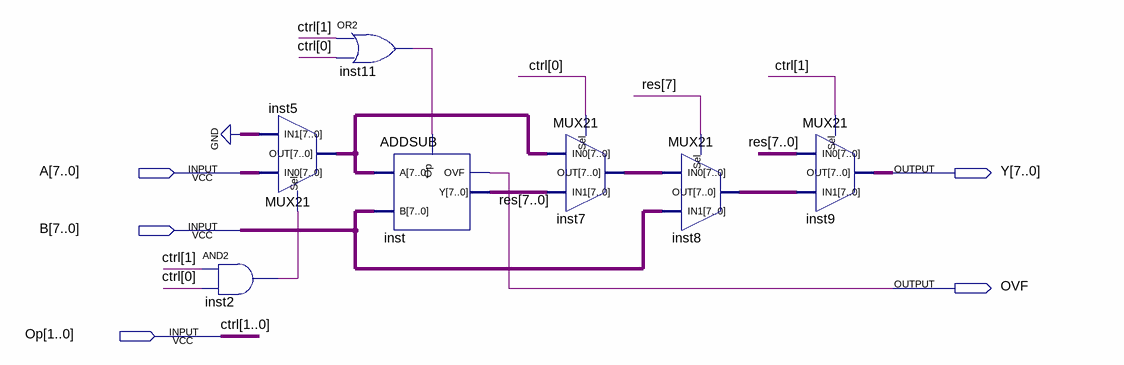
[diagram p0: schematic sheet]
// Quartus schematic AU1.bdf as structural Verilog: 7 symbols, 5 pins
module AU1 (
  input  [7:0] A,
  input  [7:0] B,
  input  [1:0] Op,
  output [7:0] Y,
  output OVF
);

  wire inst2_out, inst11_out;
  wire [7:0] inst5_out, inst7_out, inst8_out, res;

  and inst2 (inst2_out, Op[1], Op[0]);
  MUX21 inst5 (.Sel(inst2_out), .IN0(A), .IN1({8{1'b0}}), .OUT(inst5_out));
  or inst11 (inst11_out, Op[1], Op[0]);
  ADDSUB inst (.Op(inst11_out), .A(inst5_out), .B(B), .Y(res), .OVF(OVF));
  MUX21 inst7 (.Sel(Op[0]), .IN0(inst5_out), .IN1(res), .OUT(inst7_out));
  MUX21 inst8 (.Sel(res[7]), .IN0(inst7_out), .IN1(B), .OUT(inst8_out));
  MUX21 inst9 (.Sel(Op[1]), .IN0(res), .IN1(inst8_out), .OUT(Y));

  // Other names for the same wires on the sheet: ctrl[1:0] = Op
endmodule
